# EAGLE design eib-64-nanoz-adapter_OLD (EAGLE 9.6.2)
DESIGNER: JPN@MIT; DESIGN_NAME: EIB-64 NanoZ Adapter; LICENSE: CERN OHL v1.2; REVISION: 1.0
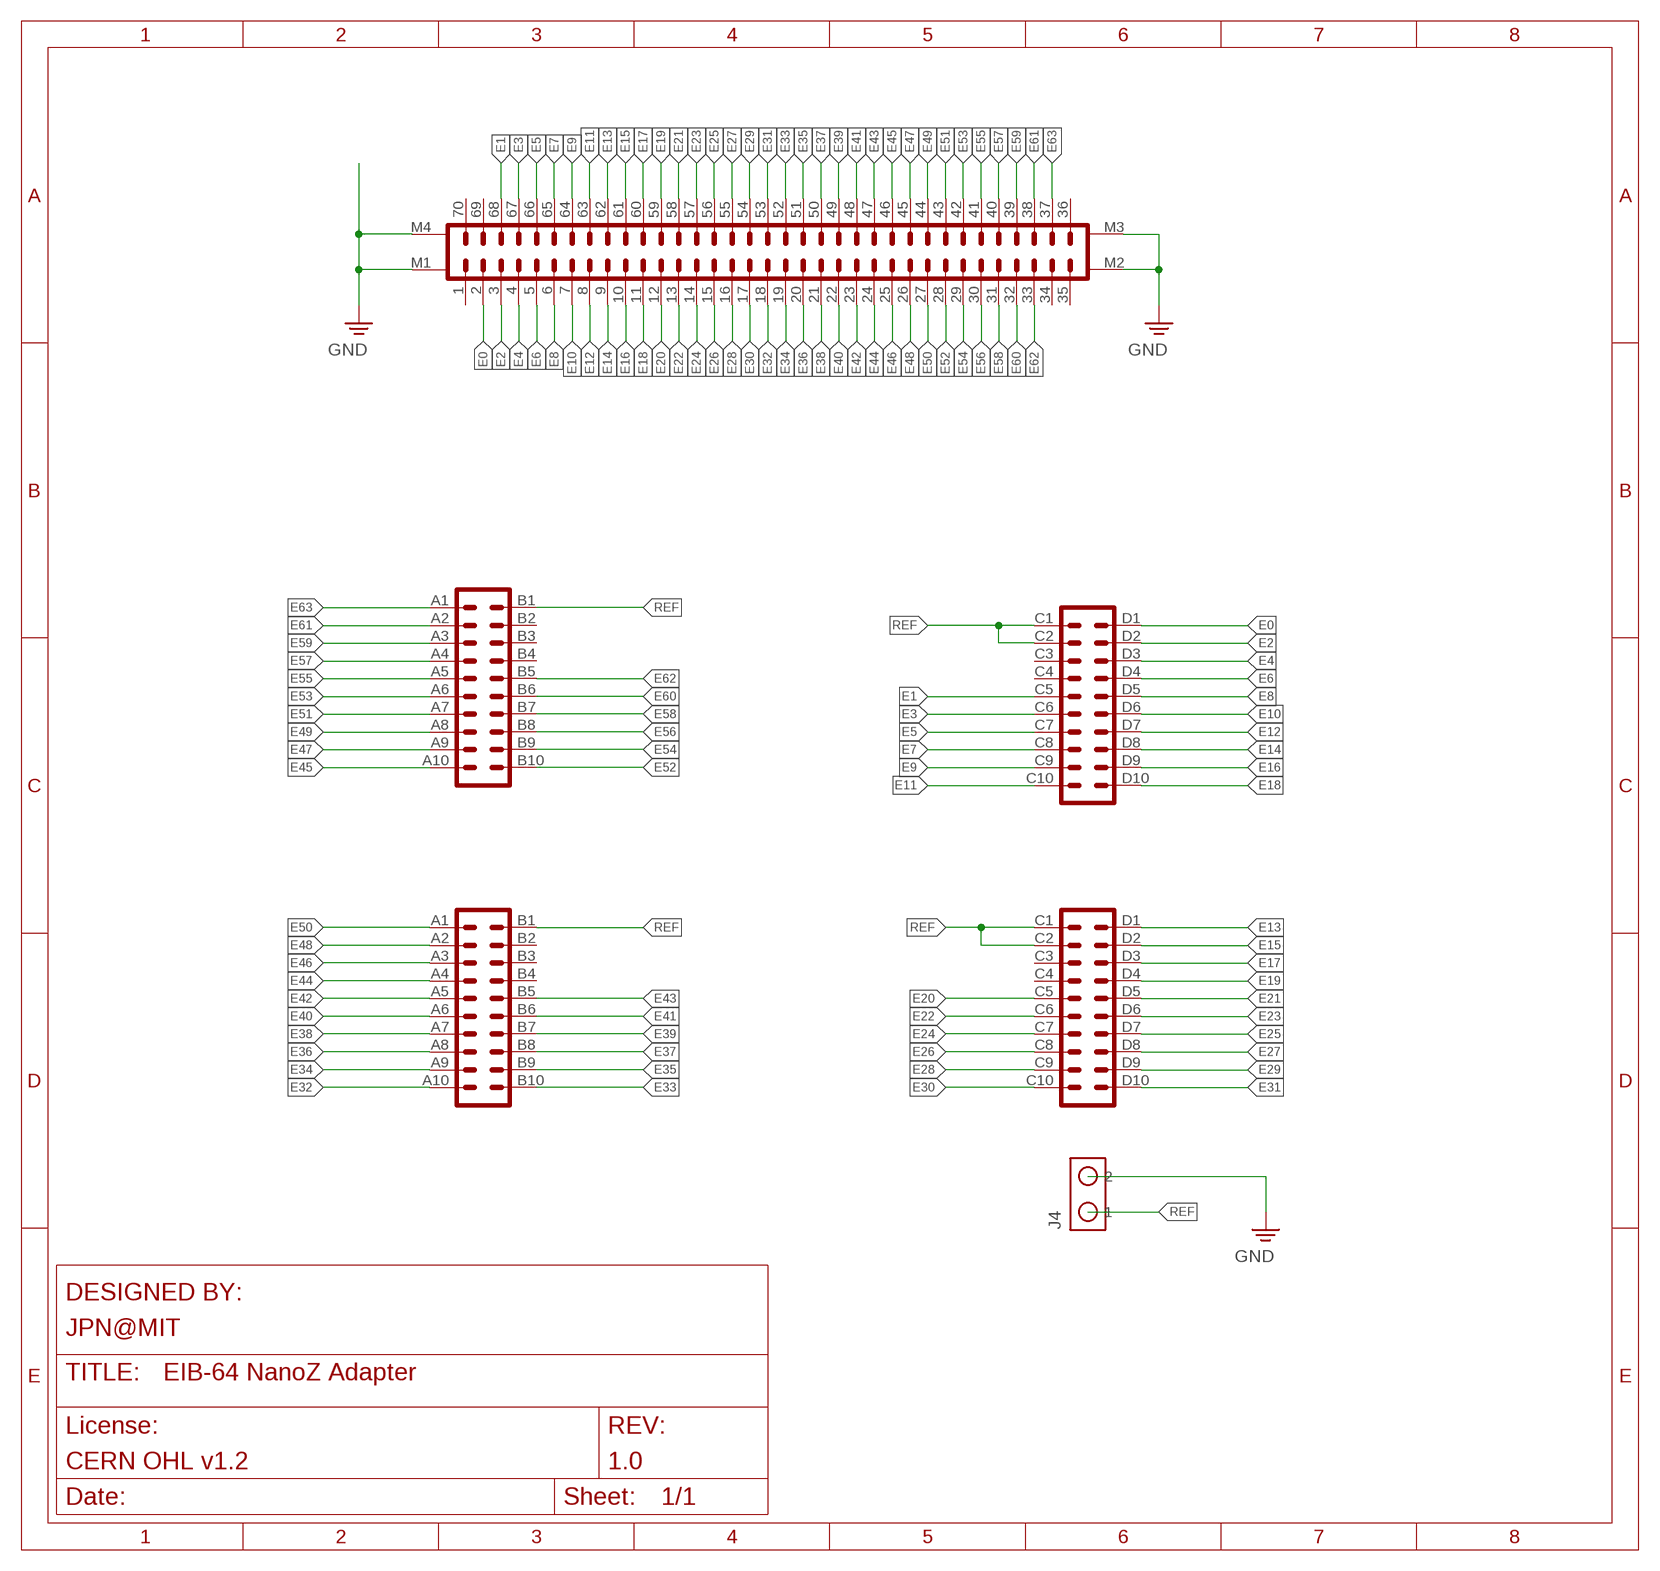
[diagram p0: schematic, sheet 1]

## Parts
J1  DF40-REC  PINHD-2X35+4_DF40-70HEAD  [DF40-70HEAD]
J2  PINHD-4X10_MOLC-THRU  [MOLC-110-11-S-Q]
J3  PINHD-4X10_MOLC-THRU  [MOLC-110-11-S-Q]
J4  SCREW2  [SCREW2]

## Nets
E0: J1.2 J2.D1
E1: J1.68 J2.C5
E2: J1.3 J2.D2
E3: J1.67 J2.C6
E4: J1.4 J2.D3
E5: J1.66 J2.C7
E6: J1.5 J2.D4
E7: J1.65 J2.C8
E8: J1.6 J2.D5
E9: J1.64 J2.C9
E10: J1.7 J2.D6
E11: J1.63 J2.C10
E12: J1.8 J2.D7
E13: J1.62 J3.D1
E14: J1.9 J2.D8
E15: J1.61 J3.D2
E16: J1.10 J2.D9
E17: J1.60 J3.D3
E18: J1.11 J2.D10
E19: J1.59 J3.D4
E20: J1.12 J3.C5
E21: J1.58 J3.D5
E22: J1.13 J3.C6
E23: J1.57 J3.D6
E24: J1.14 J3.C7
E25: J1.56 J3.D7
E26: J1.15 J3.C8
E27: J1.55 J3.D8
E28: J1.16 J3.C9
E29: J1.54 J3.D9
E30: J1.17 J3.C10
E31: J1.53 J3.D10
E32: J1.18 J3.A10
E33: J1.52 J3.B10
E34: J1.19 J3.A9
E35: J1.51 J3.B9
E36: J1.20 J3.A8
E37: J1.50 J3.B8
E38: J1.21 J3.A7
E39: J1.49 J3.B7
E40: J1.22 J3.A6
E41: J1.48 J3.B6
E42: J1.23 J3.A5
E43: J1.47 J3.B5
E44: J1.24 J3.A4
E45: J1.46 J2.A10
E46: J1.25 J3.A3
E47: J1.45 J2.A9
E48: J1.26 J3.A2
E49: J1.44 J2.A8
E50: J1.27 J3.A1
E51: J1.43 J2.A7
E52: J1.28 J2.B10
E53: J1.42 J2.A6
E54: J1.29 J2.B9
E55: J1.41 J2.A5
E56: J1.30 J2.B8
E57: J1.40 J2.A4
E58: J1.31 J2.B7
E59: J1.39 J2.A3
E60: J1.32 J2.B6
E61: J1.38 J2.A2
E62: J1.33 J2.B5
E63: J1.37 J2.A1
GND: J1.M1 J1.M2 J1.M3 J1.M4 J4.P$2
REF: J2.B1 J2.C1 J2.C2 J3.B1 J3.C1 J3.C2 J4.P$1
Unconnected: J1.1 J1.34 J1.35 J1.36 J1.69 J1.70 J2.B2 J2.B3 J2.B4 J2.C3 J2.C4 J3.B2 J3.B3 J3.B4 J3.C3 J3.C4

## Library data of the parts
J1 = jonnew:PINHD-2X35+4
J2 J3 = jonnew:PINHD-4X10
J4 = jonnew:SCREW2: Screw Terminal

## Net classes
1 thick: width 0.102 mm

## Board
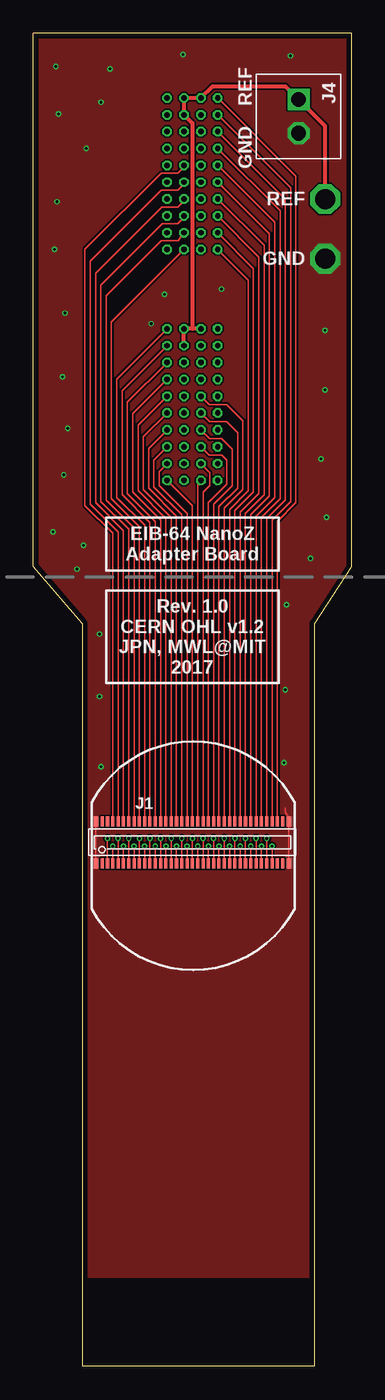
[diagram p1: board, top side]
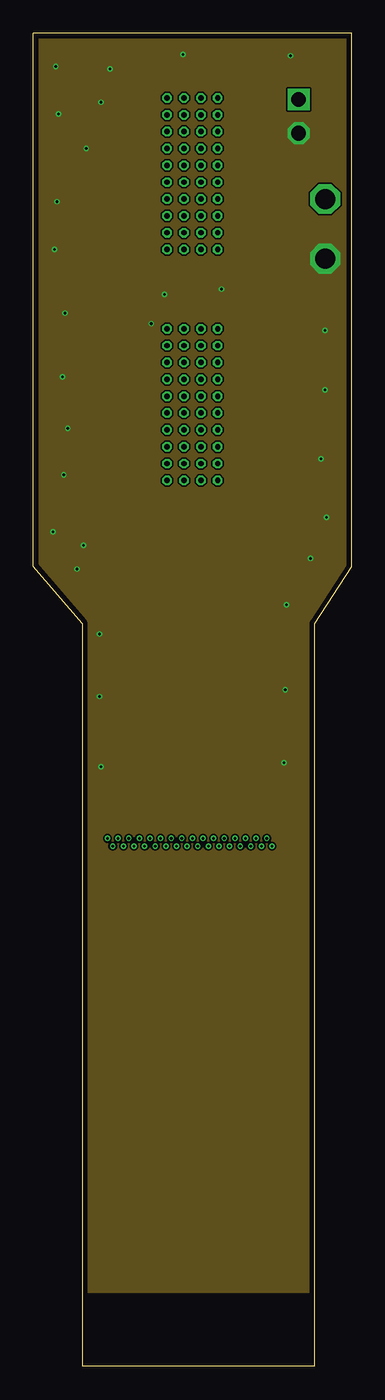
[diagram p2: board, inner layer Route2]
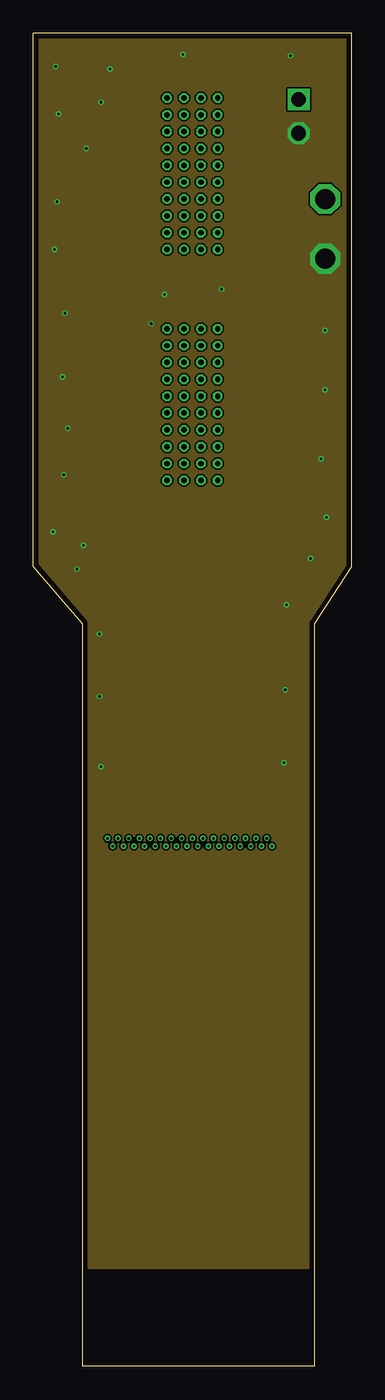
[diagram p3: board, inner layer Route15]
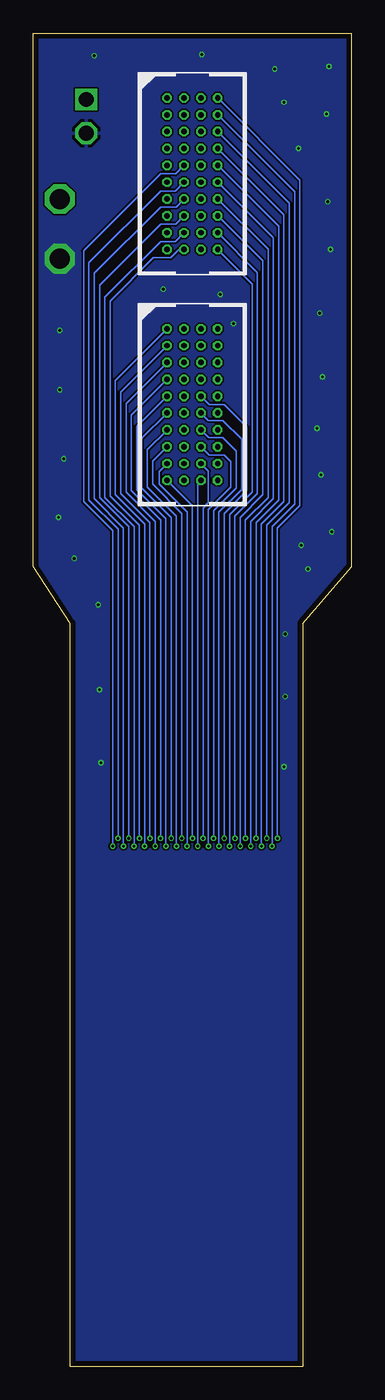
[diagram p4: board, bottom side, seen from below]

Size 24 x 100.5 mm. Coordinates in mm from the lower left corner, seen from the top.
Outline: 21.2,0 21.2,56 24,60.3 24,100.5 0,100.5 0,60.3 3.7,56 3.7,0 21.2,0
Copper layers (1*2*15*16): Top 0.035mm / dielectric 0.2mm / Route2 0.0175mm / dielectric 0.3mm / Route15 0.0175mm / dielectric 0.2mm / Bottom 0.035mm
Design rules "seeed-studio-4-layer *": minimum track width 5mil, minimum drill 0.2mm, track to track 5mil, track to pad 5mil, pad to pad 5mil, via to via 5mil, smd to smd 0mil, copper to edge 0.4mm, drill to drill 10mil, minimum pad ring 6mil, minimum via ring 4mil, stop-mask expansion 4mil, vias tented up to drill 100mil, thermal gap 10mil

### Footprints (pad centres in the part's own frame; a part is rotated, then mirrored left to right if it is on the bottom)
DF40-70HEAD = smd 0.23 x 0.75: 1 -6.8,-1.585; 2 -6.4,-1.585; 3 -6,-1.585; 4 -5.6,-1.585; 5 -5.2,-1.585; 6 -4.8,-1.585; 7 -4.4,-1.585; 8 -4,-1.585; 9 -3.6,-1.585; 10 -3.2,-1.585; 11 -2.8,-1.585; 12 -2.4,-1.585; 13 -2,-1.585; 14 -1.6,-1.585; 15 -1.2,-1.585; 16 -0.8,-1.585; 17 -0.4,-1.585; 18 0,-1.585; 19 0.4,-1.585; 20 0.8,-1.585; 21 1.2,-1.585; 22 1.6,-1.585; 23 2,-1.585; 24 2.4,-1.585; 25 2.8,-1.585; 26 3.2,-1.585; 27 3.6,-1.585; 28 4,-1.585; 29 4.4,-1.585; 30 4.8,-1.585; 31 5.2,-1.585; 32 5.6,-1.585; 33 6,-1.585; 34 6.4,-1.585; 35 6.8,-1.585; 36 6.8,1.585; 37 6.4,1.585; 38 6,1.585; 39 5.6,1.585; 40 5.2,1.585; 41 4.8,1.585; 42 4.4,1.585; 43 4,1.585; 44 3.6,1.585; 45 3.2,1.585; 46 2.8,1.585; 47 2.4,1.585; 48 2,1.585; 49 1.6,1.585; 50 1.2,1.585; 51 0.8,1.585; 52 0.4,1.585; 53 0,1.585; 54 -0.4,1.585; 55 -0.8,1.585; 56 -1.2,1.585; 57 -1.6,1.585; 58 -2,1.585; 59 -2.4,1.585; 60 -2.8,1.585; 61 -3.2,1.585; 62 -3.6,1.585; 63 -4,1.585; 64 -4.4,1.585; 65 -4.8,1.585; 66 -5.2,1.585; 67 -5.6,1.585; 68 -6,1.585; 69 -6.4,1.585; 70 -6.8,1.585 | smd 0.35 x 0.75: M1 -7.275,-1.585; M2 7.275,-1.585; M3 7.275,1.585; M4 -7.275,1.585
MOLC-110-11-S-Q = drill 0.406 octagon: A1 -1.905,5.715; A2 -1.905,4.445; A3 -1.905,3.175; A4 -1.905,1.905; A5 -1.905,0.635; A6 -1.905,-0.635; A7 -1.905,-1.905; A8 -1.905,-3.175; A9 -1.905,-4.445; A10 -1.905,-5.715; B1 -0.635,5.715; B2 -0.635,4.445; B3 -0.635,3.175; B4 -0.635,1.905; B5 -0.635,0.635; B6 -0.635,-0.635; B7 -0.635,-1.905; B8 -0.635,-3.175; B9 -0.635,-4.445; B10 -0.635,-5.715; C1 0.635,5.715; C2 0.635,4.445; C3 0.635,3.175; C4 0.635,1.905; C5 0.635,0.635; C6 0.635,-0.635; C7 0.635,-1.905; C8 0.635,-3.175; C9 0.635,-4.445; C10 0.635,-5.715; D1 1.905,5.715; D2 1.905,4.445; D3 1.905,3.175; D4 1.905,1.905; D5 1.905,0.635; D6 1.905,-0.635; D7 1.905,-1.905; D8 1.905,-3.175; D9 1.905,-4.445; D10 1.905,-5.715
SCREW2 = drill 1.1 square: P$1 0,0 | drill 1.1 octagon: P$2 2.54,0

### Placement (x,y rotation side)
J1  12,39.5 0 top
J2  12,89.9 0 bottom
J3  12,72.5 0 bottom
J4  20,95.5 270 top

### Tracks (layer width: path | path; a pad name or v marks a point on that pad's centre or on a via)
E0  (via drill 0.2)
  Top 0.127: v5.6,39.8 J1.2
  Bottom 0.127: J2.D1 3.9,89.42 3.9,64.9 5.6,63.2 v5.6,39.8
E1
  Top 0.127: J2.C5 11.49,90.54 10.89,89.94 9.64,89.94 3.9,84.2 3.9,64.9 6,62.8 J1.68
E2  (via drill 0.2)
  Top 0.127: v6,39.2 J1.3
  Bottom 0.127: J2.D2 4.3,88.55 4.3,65 6,63.3 v6,39.2
E3
  Top 0.127: J2.C6 11.49,89.27 10.89,88.67 9.67,88.67 4.3,83.3 4.3,65 6.4,62.9 J1.67
E4  (via drill 0.2)
  Top 0.127: J1.4 v6.4,39.8
  Bottom 0.127: J2.D3 4.7,87.68 4.7,65.1 6.4,63.4 v6.4,39.8
E5
  Top 0.127: J2.C7 11.49,88 10.89,87.4 9.7,87.4 4.7,82.4 4.7,65.1 6.8,63 J1.66
E6  (via drill 0.2)
  Top 0.127: J1.5 v6.8,39.2
  Bottom 0.127: J2.D4 5.1,86.81 5.1,65.2 6.8,63.5 v6.8,39.2
E7
  Top 0.127: J2.C8 11.49,86.73 10.89,86.13 9.73,86.13 5.1,81.5 5.1,65.2 7.2,63.1 J1.65
E8  (via drill 0.2)
  Top 0.127: J1.6 v7.2,39.8
  Bottom 0.127: J2.D5 5.5,85.94 5.5,65.3 7.2,63.6 v7.2,39.8
E9
  Top 0.127: J2.C9 10.93,84.86 9.66,84.86 5.5,80.7 5.5,65.3 7.6,63.2 J1.64
E10  (via drill 0.2)
  Top 0.127: J1.7 v7.6,39.2
  Bottom 0.127: J2.D6 5.9,85.07 5.9,65.4 7.6,63.7 v7.6,39.2
E11
  Top 0.127: J2.C10 5.9,78.72 5.9,65.4 8,63.3 J1.63
E12  (via drill 0.2)
  Top 0.127: J1.8 v8,39.8
  Bottom 0.127: J2.D7 6.3,84.2 6.3,65.5 8,63.8 v8,39.8
E13
  Top 0.127: J3.D1 6.3,74.42 6.3,65.5 8.4,63.4 J1.62
E14  (via drill 0.2)
  Top 0.127: J1.9 v8.4,39.2
  Bottom 0.127: J2.D8 6.7,83.33 6.7,65.7 8.4,64 v8.4,39.2
E15
  Top 0.127: J3.D2 6.7,73.55 6.7,65.7 8.8,63.6 8.8,42.2 | 8.8,42.2 8.8,42.1 | 8.8,42.2 J1.61
E16  (via drill 0.2)
  Top 0.127: J1.10 v8.8,39.8
  Bottom 0.127: 8.8,42 8.8,64.1 7.1,65.8 7.1,82.46 J2.D9 | 8.8,42 8.8,41.9 | v8.8,39.8 8.8,42
E17
  Top 0.127: J3.D3 7.1,72.68 7.1,65.8 9.2,63.7 J1.60
E18  (via drill 0.2)
  Top 0.127: J1.11 v9.2,39.2
  Bottom 0.127: J2.D10 7.5,81.59 7.5,65.9 9.2,64.2 v9.2,39.2
E19
  Top 0.127: J3.D4 7.5,71.81 7.5,65.9 9.6,63.8 J1.59
E20  (via drill 0.2)
  Top 0.127: J1.12 v9.6,39.8
  Bottom 0.127: J3.C5 10.73,72.5 9.6,72.5 7.9,70.8 7.9,66 9.6,64.3 v9.6,39.8
E21
  Top 0.127: J3.D5 7.9,70.94 7.9,66 10,63.9 J1.58
E22  (via drill 0.2)
  Top 0.127: J1.13 v10,39.2
  Bottom 0.127: J3.C6 10.8,71.3 9.7,71.3 8.3,69.9 8.3,66.1 10,64.4 v10,39.2
E23
  Top 0.127: J3.D6 8.3,70.07 8.3,66.1 10.4,64 J1.57
E24  (via drill 0.2)
  Top 0.127: J1.14 v10.4,39.8
  Bottom 0.127: J3.C7 10.77,70 9.7,70 8.7,69 8.7,66.2 10.4,64.5 v10.4,39.8
E25
  Top 0.127: J3.D7 8.7,69.2 8.7,66.2 10.8,64.1 J1.56
E26  (via drill 0.2)
  Top 0.127: J1.15 v10.8,39.2
  Bottom 0.127: J3.C8 10.74,68.7 9.6,68.7 9.1,68.2 9.1,66.3 10.8,64.6 v10.8,39.2
E27
  Top 0.127: J3.D8 9.1,68.33 9.1,66.3 11.2,64.2 J1.55
E28  (via drill 0.2)
  Top 0.127: J1.16 v11.2,39.8
  Bottom 0.127: J3.C9 10.8,67.49 10.8,65.1 11.2,64.7 v11.2,39.8
E29
  Top 0.127: J3.D9 9.5,67.46 9.5,66.4 11.6,64.3 J1.54
E30  (via drill 0.2)
  Top 0.127: J1.17 v11.6,39.2
  Bottom 0.127: J3.C10 11.6,66.55 v11.6,39.2
E31
  Top 0.127: J3.D10 12,64.88 J1.53
E32  (via drill 0.2)
  Top 0.127: J1.18 v12,39.8
  Bottom 0.127: J3.A10 12,64.88 v12,39.8
E33
  Top 0.127: J3.B10 12.4,66.55 J1.52
E34  (via drill 0.2)
  Top 0.127: J1.19 v12.4,39.2
  Bottom 0.127: J3.A9 14.5,67.46 14.5,66.5 12.4,64.4 v12.4,39.2
E35
  Top 0.127: J3.B9 13.3,67.39 13.3,66.4 12.8,65.9 J1.51
E36  (via drill 0.2)
  Top 0.127: J1.20 v12.8,39.8
  Bottom 0.127: J3.A8 15,68.23 15,66.5 12.8,64.3 v12.8,39.8
E37
  Top 0.127: J3.B8 13.26,68.7 14.2,68.7 14.6,68.3 14.6,66.5 13.2,65.1 J1.50
E38  (via drill 0.2)
  Top 0.127: J1.21 v13.2,39.2
  Bottom 0.127: J3.A7 15.4,69.1 15.4,66.3 13.2,64.1 v13.2,39.2
E39
  Top 0.127: J3.B7 13.29,69.94 14.2,69.94 15,69.13 15,66.4 13.6,65 J1.49
E40  (via drill 0.2)
  Top 0.127: J1.22 v13.6,39.79 v13.59,39.8
  Bottom 0.127: J3.A6 15.8,69.97 15.8,66.2 13.6,64 13.6,41.9 13.59,41.89 v13.59,39.8
E41
  Top 0.127: J3.B6 13.29,71.2 13.3,71.2 14.6,71.2 15.4,70.4 15.4,66.2 14,64.8 14,43 | 14,43 14,42.9 | 14,43 J1.48
E42  (via drill 0.2)
  Top 0.127: J1.23 v14,39.2
  Bottom 0.127: J3.A5 16.2,70.84 16.2,66.1 14,63.9 v14,39.2
E43
  Top 0.127: J3.B5 | J3.B5 13.27,72.5 14.6,72.5 15.8,71.3 15.8,66.1 14.4,64.7 J1.47
E44  (via drill 0.2)
  Top 0.127: J1.24 v14.4,39.8
  Bottom 0.127: J3.A4 16.6,71.71 16.6,66 14.4,63.8 v14.4,39.8
E45
  Top 0.127: J2.A10 16.2,81.89 16.2,66 14.8,64.6 J1.46
E46  (via drill 0.2)
  Top 0.127: J1.25 v14.8,39.2
  Bottom 0.127: J3.A3 17,72.58 17,65.9 14.8,63.7 v14.8,39.2
E47
  Top 0.127: J2.A9 16.6,82.76 16.6,65.9 15.2,64.5 15.2,42.2 | 15.2,42.2 15.2,42.1 | 15.2,42.2 J1.45
E48  (via drill 0.2)
  Top 0.127: J1.26 v15.2,39.8
  Bottom 0.127: J3.A2 17.4,73.45 17.4,65.8 15.2,63.6 v15.2,39.8
E49
  Top 0.127: J2.A8 17,83.63 17,65.8 15.6,64.4 J1.44
E50  (via drill 0.2)
  Top 0.127: J1.27 v15.6,39.2
  Bottom 0.127: J3.A1 17.8,74.32 17.8,65.7 15.6,63.5 v15.6,39.2
E51
  Top 0.127: J2.A7 17.4,84.5 17.4,65.7 16,64.3 J1.43
E52  (via drill 0.2)
  Top 0.127: J1.28 v16,39.8
  Bottom 0.127: J2.B10 13.03,84.19 13.65,83.57 14.93,83.57 18.2,80.3 18.2,65.6 16,63.4 v16,39.8
E53
  Top 0.127: J2.A6 17.8,85.37 17.8,65.6 16.4,64.2 J1.42
E54  (via drill 0.2)
  Top 0.127: J1.29 v16.4,39.2
  Bottom 0.127: J2.B9 13.3,84.8 14.4,84.8 18.6,80.6 18.6,65.5 16.4,63.3 v16.4,39.2
E55
  Top 0.127: J2.A5 18.2,86.24 18.2,65.5 16.8,64.1 J1.41
E56  (via drill 0.2)
  Top 0.127: J1.30 v16.8,39.8
  Bottom 0.127: J2.B8 13.26,86.1 14.4,86.1 19,81.5 19,65.5 16.8,63.3 v16.8,39.8
E57
  Top 0.127: J2.A4 18.6,87.11 18.6,65.4 17.2,64 17.2,43 | 17.2,43 17.2,42.9 | 17.2,43 J1.40
E58  (via drill 0.2)
  Top 0.127: J1.31 v17.2,39.2
  Bottom 0.127: J2.B7 13.23,87.4 14.4,87.4 19.4,82.4 19.4,65.4 17.2,63.2 v17.2,39.2
E59
  Top 0.127: J2.A3 19,87.98 19,65.3 17.6,63.9 J1.39
E60  (via drill 0.2)
  Top 0.127: J1.32 v17.6,39.8
  Bottom 0.127: J2.B6 13.3,88.6 14.4,88.6 19.8,83.2 19.8,65.3 17.6,63.1 v17.6,39.8
E61
  Top 0.127: J2.A2 19.4,88.85 19.4,65.2 18,63.8 18,43 | 18,43 18,42.9 | 18,43 J1.38
E62  (via drill 0.2)
  Top 0.127: J1.33 v18,39.2
  Bottom 0.127: J2.B5 13.27,89.9 14.4,89.9 20.2,84.1 20.2,65.2 18,63 v18,39.2
E63
  Top 0.127: J2.A1 19.8,89.72 19.8,65.1 18.4,63.7 18.4,41.8 | 18.4,41.8 J1.37 | 18.4,41.8
GND  (via drill 0.2, 1.5)
  Top 0.127: J1.M1 J1.M4 | J1.M2 J1.M3 19.27,41.33 19,41.8 19,42.1
  other vias: 22,83.5 20.9,60.9 22.1,64 21.7,68.4 22,73.6 22,78.1 2.2,74.6 2.3,67.2 3.3,60.1 3.8,61.9 1.6,84.2 4,91.8 1.7,98 11.3,98.9 5.8,97.8 19.4,98.8 14.2,81.2 9.9,80.8 8.9,78.6 1.5,62.9 2.6,70.7 2.4,79.4 1.8,87.8 1.9,94.4 5.1,95.3 5.1,45.2 18.9,45.5 19,51 19.1,57.4 5,55.2 5,50.5
  pour Top (rank 3, no thermals): -4,104.5 26,104.5 26,6.7 -4,6.7
  pour Route2 (rank 3, no thermals): -2.7,103.6 27.3,103.6 27.3,5.6 -2.7,5.6
  pour Route15 (rank 3, no thermals): -5.4,105.4 24.6,105.4 24.6,7.4 -5.4,7.4
  pour Bottom: -4.8,107.3 30.5,107.3 30.7,107.5 30.7,-4.6 30.9,-4.8 -1.7,-4.8 -2.1,-4.4 -4.8,-1.7
REF  (via drill 1.5)
  Top 0.305: 12,78.22 12,93.71 J2.C2 J2.C1 J2.B1 13.52,96.5 19,96.5 J4.P$1 22,93.5 v22,88 | J3.B1 12,78.22 | 12,78.22 J3.C1 J3.C2

### Text on the board
tPlace: REF | GND | REF | GND | EIB-64 NanoZ / Adapter Board | Rev. 1.0 / CERN OHL v1.2 / JPN, MWL@MIT / 2017